# Altium schematic sheet RPi_Peripheral_HAT.SchDoc: Raspberry Pi Peripherals
size A4; DocumentNumber: SCH-PI-SHIELD; Revision: A; SheetNumber: 3; SheetTotal: 3
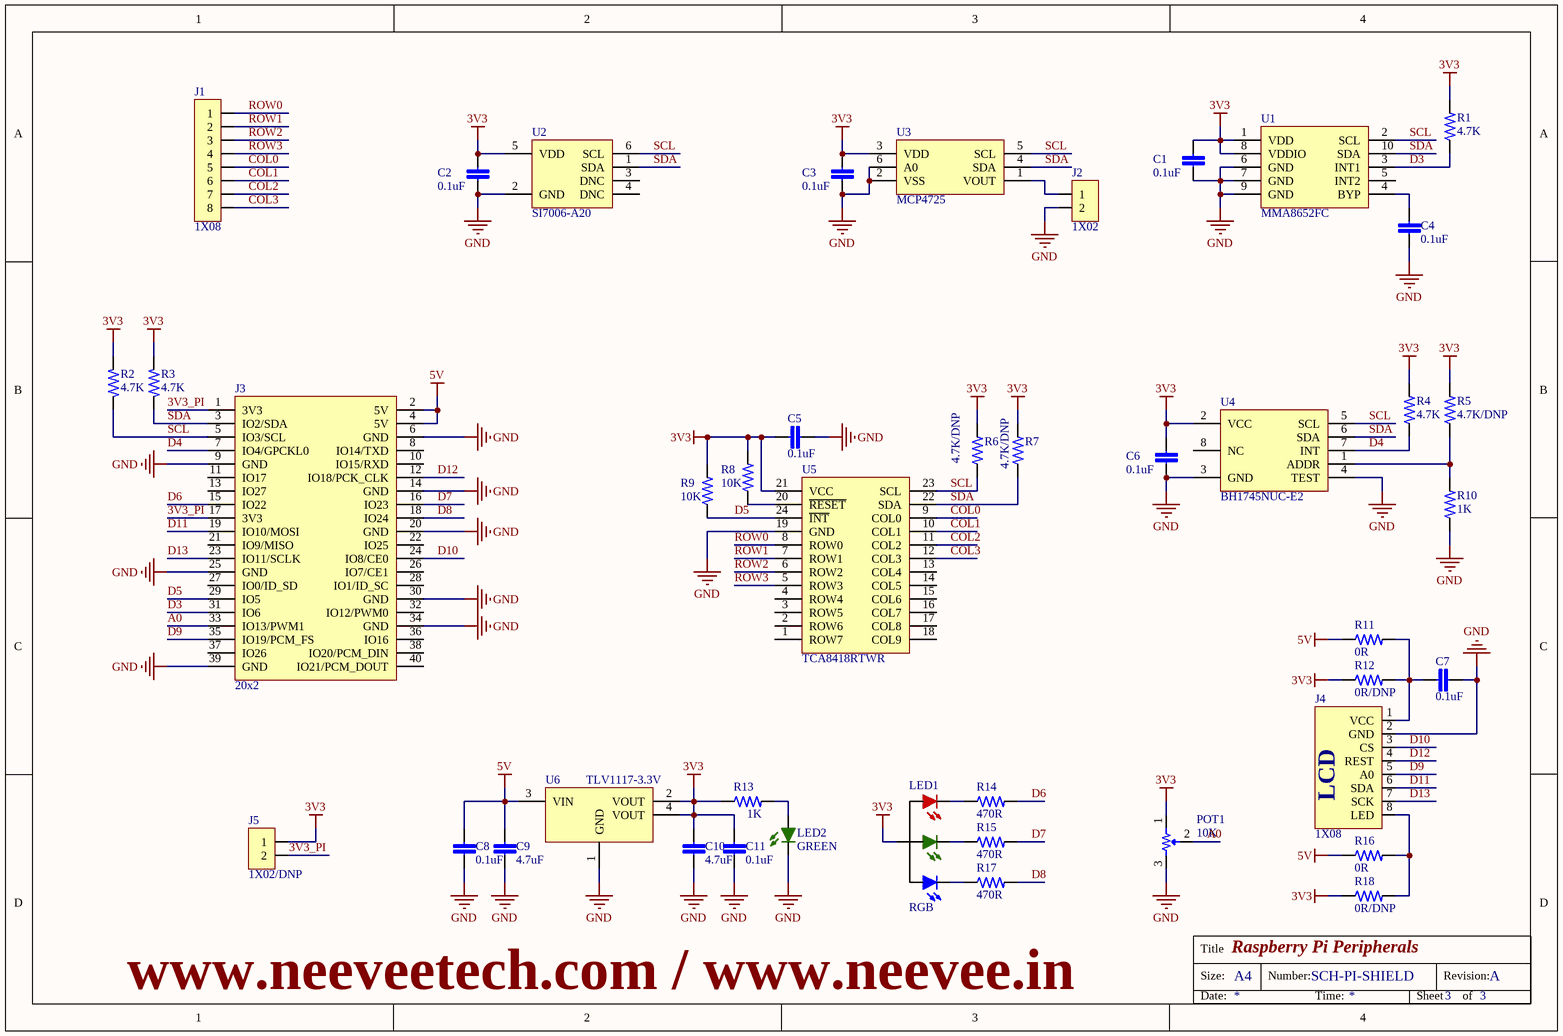
[diagram p0: RPi_Peripheral_HAT.SchDoc]

## Parts
C1  0.1uF  [C0603]
C2  0.1uF  [C0603]
C3  0.1uF  [C0603]
C4  0.1uF  [C0603]
C5  0.1uF  [C0603]
C6  0.1uF  [C0603]
C7  0.1uF  [C0603]
C8  0.1uF  [C0603]
C9  4.7uF  [C0603]
C10  4.7uF  [C0603]
C11  0.1uF  [C0603]
J1  1X08  [CON_1X08_2.54mm_male_TH]
J2  1X02  [CON_1X02_5MM]
J3  20x2  [RPI_HEADER_2X20_FEMALE]
J4  1X08  [CON_1X08_2.54mm_Female_TH]
J5  1X02/DNP  [CON_1X02_2.54mm_Male]
LED1  RGB  [PLCC4]
LED2  GREEN  [LED_0805_GREEN]
POT1  10K  [PTV09A_POTENTIOMETER]
R1  4.7K  [R0603]
R2  4.7K  [R0603]
R3  4.7K  [R0603]
R4  4.7K  [R0603]
R5  4.7K/DNP  [R0603]
R6  4.7K/DNP  [R0603]
R7  4.7K/DNP  [R0603]
R8  10K  [R0603]
R9  10K  [R0603]
R10  1K  [R0603]
R11  0R  [R0603]
R12  0R/DNP  [R0603]
R13  1K  [R0603]
R14  470R  [R0603]
R15  470R  [R0603]
R16  0R  [R0603]
R17  470R  [R0603]
R18  0R/DNP  [R0603]
U1  MMA8652FC  [DFN10]
U2  SI7006-A20  [DFN6]
U3  MCP4725  [SOT23-6]
U4  BH1745NUC-E2  [DFN8]
U5  TCA8418RTWR  [QFN24-0.5mm]
U6  TLV1117-3.3V  [SOT223]

## Nets
3V3: C1.2 C2.2 C3.2 C5.2 C6.2 C10.1 C11.2 J5.1 LED1.1(CA) POT1.1 R1.2 R2.2 R3.2 R4.2 R5.2 R6.2 R7.2 R8.2 R9.2 R12.1 R13.1 R18.1 U1.1(VDD) U1.8(VDDIO) U2.5(VDD) U3.3(VDD) U4.2(VCC) U5.21(VCC) U6.2(VOUT) U6.4(VOUT)
5V: C8.2 C9.1 J3.2(5V) J3.4(5V) R11.1 R16.1 U6.3(VIN)
GND: C1.1 C2.1 C3.1 C4.2 C5.1 C6.1 C7.2 C8.1 C9.2 C10.2 C11.1 J2.2 J3.6(GND) J3.9(GND) J3.14(GND) J3.20(GND) J3.25(GND) J3.30(GND) J3.34(GND) J3.39(GND) J4.2(GND) LED2.C POT1.3 R10.1 U1.6(GND) U1.7(GND) U1.9(GND) U2.2(GND) U3.2(VSS) U3.6(A0) U4.3(GND) U4.4(TEST) U5.19(GND) U6.1(GND)
3V3_PI: J3.1(3V3) J3.17(3V3) J5.2
A0: J3.33(IO13/PWM1) POT1.2
COL0: J1.5 U5.9(COL0)
COL1: J1.6 U5.10(COL1)
COL2: J1.7 U5.11(COL2)
COL3: J1.8 U5.12(COL3)
D3: J3.31(IO6) R1.1 U1.3(INT1)
D4: J3.7(IO4/GPCKL0) R4.1 U4.7(INT)
D5: J3.29(IO5) R9.1 U5.24(~{INT})
D6: J3.15(IO22) R14.2
D7: J3.16(IO23) R15.2
D8: J3.18(IO24) R17.2
D9: J3.35(IO19/PCM_FS) J4.5(A0)
D10: J3.24(IO8/CE0) J4.3(CS)
D11: J3.19(IO10/MOSI) J4.6(SDA)
D12: J3.12(IO18/PCK_CLK) J4.4(REST)
D13: J3.23(IO11/SCLK) J4.7(SCK)
ROW0: J1.1 U5.8(ROW0)
ROW1: J1.2 U5.7(ROW1)
ROW2: J1.3 U5.6(ROW2)
ROW3: J1.4 U5.5(ROW3)
SCL: J3.5(IO3/SCL) R2.1 R6.1 U1.2(SCL) U2.6(SCL) U3.5(SCL) U4.5(SCL) U5.23(SCL)
SDA: J3.3(IO2/SDA) R3.1 R7.1 U1.10(SDA) U2.1(SDA) U3.4(SDA) U4.6(SDA) U5.22(SDA)
NetC4_1: C4.1 U1.4(BYP)
NetC7_1: C7.1 J4.1(VCC) R11.2 R12.2
NetJ2_1: J2.1 U3.1(VOUT)
NetJ4_8: J4.8(LED) R16.2 R18.2
NetLED1_2: LED1.2(BLUE) R17.1
NetLED1_3: LED1.3(GREEN) R15.1
NetLED1_4: LED1.4(RED) R14.1
NetLED2_A: LED2.A R13.2
NetR5_1: R5.1 R10.2 U4.1(ADDR)
NetR8_1: R8.1 U5.20(~{RESET})

Not connected (* = marked no-connect by the designer): J3 8(IO14/TXD) 10(IO15/RXD) 11(IO17) 13(IO27) 21(IO9/MISO) 22(IO25) 26(IO7/CE1) 27(IO0/ID_SD) 28(IO1/ID_SC) 32(IO12/PWM0) 36(IO16) 37(IO26) 38(IO20/PCM_DIN) 40(IO21/PCM_DOUT); U1 5(INT2); U2 3(DNC) 4(DNC); U4 8(NC); U5 1(ROW7) 2(ROW6) 3(ROW5) 4(ROW4) 13(COL4) 14(COL5) 15(COL6) 16(COL7) 17(COL8) 18(COL9)

## Notes on the sheet
- www.neeveetech.com / www.neevee.in
- Title
- Size:
- A4
- Number:
- Revision:
- Date:
- Time:
- Sheet
- of
- (in symbol 1.44Inch_TFT_LCD_Con) LCD

## Library data of the parts
C1-C8 C11 = C0603_0.1uF: Cap Ceramic 0.1uF 50V X7R 20% SMD 0603 125C T/R; Manufacturer: KEMET; Manufacturer Part Number: C0603C104M5RACTU; Capacitance: 100nF; Dissipation Factor: 2.5%; Supplier 1: Element14; Supplier Part Number 1: 2725587; Stock 1: 8000; Mount: Surface Mount,PCB; Case/Package: 0603; Case Code (Metric): 1608; Case Code (Imperial): 0603; Dielectric Material: Ceramic; Contact Plating: Tin,Matte; Min Operating Temperature: -55°C; Max Operating Temperature: 125°C; Tolerance: 20%; Dielectric: X7R; Package Quantity: 1; Voltage Rating: 50V; Packaging: Tape and Reel; Voltage Rating (DC): 50V; Termination: SMD/SMT; Length: 1.6mm; Height: 0.8mm; Width: 0.031inch; Thickness: 0.034inch; Lead Pitch: 0.7mm; Depth: 0.8mm; Radiation Hardening: No; REACH SVHC: No SVHC; ComponentLink1URL: http://www.farnell.com/datasheets/2746056.pdf?src-supplier=Element14; ComponentLink1Description: http://www.farnell.com/datasheets/2746056.pdf?src-supplier=Element14; ComponentLink2URL: http://www.mouser.com/ds/2/212/KEM_C1002_X7R_SMD-1102033.pdf?src-supplier=Mouser; ComponentLink2Description: http://www.mouser.com/ds/2/212/KEM_C1002_X7R_SMD-1102033.pdf?src-supplier=Mouser; ComponentLink3URL: https://www.verical.com/server-webapp/html/getDatasheet?partID=626892&src-supplier=Verical; ComponentLink3Description: https://www.verical.com/server-webapp/html/getDatasheet?partID=626892&src-supplier=Verical; ComponentLink4URL: http://components.arrow.com/part/dataview/40911037S8853915N7429?src-supplier=Arrow; ComponentLink4Description: http://components.arrow.com/part/dataview/40911037S8853915N7429?src-supplier=Arrow; ComponentLink5URL: http://capacitoredge.kemet.com/capedge2/DataSheet?pn=C0603C104M5RAC7867&src-supplier=Avnet; ComponentLink5Description: http://capacitoredge.kemet.com/capedge2/DataSheet?pn=C0603C104M5RAC7867&src-supplier=Avnet; ComponentLink6URL: http://capacitoredge.kemet.com/capedge2/DataSheet?pn=C0603C104M5RAC7867&src-supplier=Avnet+Asia; ComponentLink6Description: http://capacitoredge.kemet.com/capedge2/DataSheet?pn=C0603C104M5RAC7867&src-supplier=Avnet+Asia; ComponentLink7URL: http://www.farnell.com/datasheets/2746056.pdf?src-supplier=Farnell; ComponentLink7Description: http://www.farnell.com/datasheets/2746056.pdf?src-supplier=Farnell; ComponentLink8URL: http://www.farnell.com/datasheets/2746056.pdf?src-supplier=Newark; ComponentLink8Description: http://www.farnell.com/datasheets/2746056.pdf?src-supplier=Newark; ComponentLink9URL: http://www.alliedelec.com/m/d/6f3b5eb83d09db50ed28bdc730567b33.pdf?src-supplier=Allied+Electronics; ComponentLink9Description: http://www.alliedelec.com/m/d/6f3b5eb83d09db50ed28bdc730567b33.pdf?src-supplier=Allied+Electronics; ComponentLink10URL: https://api.kemet.com/component-edge/download/datasheet/C0603C104M5RACTU.pdf?src-supplier=Digi-Key; ComponentLink10Description: https://api.kemet.com/component-edge/download/datasheet/C0603C104M5RACTU.pdf?src-supplier=Digi-Key; ComponentLink11URL: http://www.farnell.com/datasheets/2315113.pdf?src-supplier=Newark; ComponentLink11Description: http://www.farnell.com/datasheets/2315113.pdf?src-supplier=Newark; ComponentLink12URL: http://www.farnell.com/datasheets/1828800.pdf?src-supplier=Newark; ComponentLink12Description: http://www.farnell.com/datasheets/1828800.pdf?src-supplier=Newark; ComponentLink13URL: http://components.arrow.com/part/dataview/0323_00313986?src-supplier=Arrow+Europe; ComponentLink13Description: http://components.arrow.com/part/dataview/0323_00313986?src-supplier=Arrow+Europe; ComponentLink14URL: https://www.verical.com/server-webapp/html/getDatasheet?partID=110138&src-supplier=Verical; ComponentLink14Description: https://www.verical.com/server-webapp/html/getDatasheet?partID=110138&src-supplier=Verical
C9 C10 = C0603_4.7uF_10V: 4.7µF ±10% 10V Ceramic Capacitor X6S 0603 (1608 Metric); Manufacturer: TDK; Manufacturer Part Number: C1608X6S1A475K080AC; Supplier 1: Element14; Supplier Part Number 1: 2525106; Stock 1: 2640; Mount: Surface Mount; Case/Package: 0603; Number of Pins: 2; Weight: 7.1E-05oz; Case Code (Metric): 1608; Case Code (Imperial): 0603; Dielectric Material: Ceramic; Min Operating Temperature: -55°C; Max Operating Temperature: 105°C; Tolerance: 10%; Capacitance: 4.7uF; Dielectric: X6S; Packaging: Tape and Reel; Voltage Rating: 10V; Voltage Rating (DC): 10V; Termination: SMD/SMT; Package Quantity: 4000; Composition: Ceramic; Length: 1.6mm; Height: 0.8mm; Depth: 0.8mm; Width: 0.031inch; Thickness: 0.035inch; Radiation Hardening: No; Lead Free: Lead Free; REACH SVHC: Unknown; ComponentLink1URL: http://www.farnell.com/datasheets/2792994.pdf?src-supplier=Newark; ComponentLink1Description: http://www.farnell.com/datasheets/2792994.pdf?src-supplier=Newark; ComponentLink2URL: https://product.tdk.com/info/en/catalog/spec/mlccspec_commercial_general_midvoltage_en.pdf?src-supplier=Digi-Key; ComponentLink2Description: https://product.tdk.com/info/en/catalog/spec/mlccspec_commercial_general_midvoltage_en.pdf?src-supplier=Digi-Key; ComponentLink3URL: http://www.tdk.co.jp/tefe02/e412_c.pdf?src-supplier=Future+Electronics; ComponentLink3Description: http://www.tdk.co.jp/tefe02/e412_c.pdf?src-supplier=Future+Electronics; ComponentLink4URL: http://www.farnell.com/datasheets/1913358.pdf?src-supplier=Element14; ComponentLink4Description: http://www.farnell.com/datasheets/1913358.pdf?src-supplier=Element14; ComponentLink5URL: http://www.tdk.co.jp/tefe02/e412_c.pdf?src-supplier=Avnet+Europe; ComponentLink5Description: http://www.tdk.co.jp/tefe02/e412_c.pdf?src-supplier=Avnet+Europe; ComponentLink6URL: http://www.mouser.com/ds/2/400/lcc_commercial_general_en-837201.pdf?src-supplier=Mouser; ComponentLink6Description: http://www.mouser.com/ds/2/400/lcc_commercial_general_en-837201.pdf?src-supplier=Mouser
J1 = CON_1X08_2.54mm_male_TH: Connector Header Through Hole 8 position 0.100" (2.54mm); Manufacturer: Amphenol FCI; Manufacturer Part Number: 77311-818-08LF; Number of Contacts: 8; Connector Type: Male Pin; Current Rating: 3A; Voltage Rating: 1.5kV; Insulation Resistance: 5GR; Gender: Male; Contact Post Length: 3.05mm; Supplier 1: Element14; Supplier Part Number 1: 3273024; Stock 1: 0; Mount: Through Hole; Contact Plating: Gold,GXT; Color: Black; Contact Material: Bronze; Housing Color: Black; Housing Material: Thermoplastic; Min Operating Temperature: -65°C; Max Operating Temperature: 125°C; Number of Rows: 1; Termination: Solder; Packaging: Bulk; Package Quantity: 500; Number of Positions: 8; Contact Gender: Male; Max Voltage Rating (AC): 1.5kV; Orientation: Straight; Length: 20.32mm; Pitch: 2.54mm; Contact Mating Length: 0.23inch; Depth: 2.4mm; Radiation Hardening: No; Lead Free: Lead Free; Flammability Rating: UL94 V-0; ComponentLink1URL: http://portal.fciconnect.com/Comergent//fci/drawing/77311.pdf?src-supplier=Digi-Key; ComponentLink1Description: http://portal.fciconnect.com/Comergent//fci/drawing/77311.pdf?src-supplier=Digi-Key; ComponentLink2URL: http://portal.fciconnect.com/Comergent/fci/drawing/77311.pdf?src-supplier=Avnet; ComponentLink2Description: http://portal.fciconnect.com/Comergent/fci/drawing/77311.pdf?src-supplier=Avnet
J2 = CON_1X02_5mm: Wire-To-Board Terminal Block, 5 mm, 2 Ways, 22 AWG, 14 AWG, 1.5 mm, Screw; Manufacturer: Camden Electronics Boss; Manufacturer Part Number: CTBP5000/2; Current Rating: 16A; Voltage Rating: 250V; Wire/Cable Gauge: 22AWG; Supplier 1: Element14; Supplier Part Number 1: 2527547; Stock 1: 4037; REACH SVHC: No SVHC; ComponentLink1URL: http://www.farnell.com/datasheets/2018285.pdf?src-supplier=Farnell; ComponentLink1Description: http://www.farnell.com/datasheets/2018285.pdf?src-supplier=Farnell; ComponentLink2URL: http://www.farnell.com/datasheets/2018285.pdf?src-supplier=Element14; ComponentLink2Description: http://www.farnell.com/datasheets/2018285.pdf?src-supplier=Element14
J3 = RPI_HEADER_20X2_FEMALE: GPIO FEMALE HEADER RASPBERRY PI; Manufacturer: Adafruit Industries; Manufacturer Part Number: 2222; Supplier 1: Digi-Key; Supplier Part Number 1: 1528-1785-ND; Stock 1: 1455; Pricing 1: 1=1.5 (USD); ComponentLink1URL: https://cdn-shop.adafruit.com/product-files/2222/00587.pdf?src-supplier=Digi-Key; ComponentLink1Description: https://cdn-shop.adafruit.com/product-files/2222/00587.pdf?src-supplier=Digi-Key
J4 = 1.44Inch_TFT_LCD_Con: Board-To-Board Connector, 2.54 mm, 10 Contacts, Receptacle, 2212S Series, Through Hole, 1 Rows; Manufacturer: Multicomp; Manufacturer Part Number: 2212S-10SG-85; Number of Contacts: 10; Insulation Resistance: 1GR; Supplier 1: Element14; Supplier Part Number 1: 1593464; Stock 1: 6706; Mount: Through Hole; Weight: 0.11lb; Contact Plating: Gold; Contact Material: Copper Alloy; Number of Rows: 1; Termination: Through Hole; Gender: Receptacle; Length: 1.02inch; Height: 0.35inch; Width: 0.12inch; REACH SVHC: No SVHC; Flammability Rating: UL94 V-0; ComponentLink1URL: http://www.farnell.com/datasheets/1662126.pdf?src-supplier=Element14; ComponentLink1Description: http://www.farnell.com/datasheets/1662126.pdf?src-supplier=Element14
J5 = CON_1X02_2.54mm_Male: Connector Header Through Hole 2 position 0.100" (2.54mm); Manufacturer: Amphenol FCI; Manufacturer Part Number: 77311-818-02LF; Number of Contacts: 2; Current Rating: 3A; Voltage Rating: 1.5kV; Gender: Male; Connector Type: Male Pin; Insulation Resistance: 5GR; Contact Post Length: 3.05mm; DNP: YES; Supplier 1: Element14; Supplier Part Number 1: 2892471; Stock 1: 990; Mount: Through Hole; Contact Plating: Gold,GXT; Color: Black; Contact Material: Bronze; Housing Material: Thermoplastic; Housing Color: Black; Min Operating Temperature: -65°C; Max Operating Temperature: 125°C; Number of Rows: 1; Termination: Solder; Package Quantity: 1000; Packaging: Bulk; Number of Positions: 2; Max Voltage Rating (AC): 1.5kV; Orientation: Straight; Contact Gender: Male; Length: 5.08mm; Pitch: 2.54mm; Depth: 2.4mm; Contact Mating Length: 0.23inch; Radiation Hardening: No; Lead Free: Lead Free; ComponentLink1URL: http://portal.fciconnect.com/Comergent//fci/drawing/77311.pdf?src-supplier=Digi-Key; ComponentLink1Description: http://portal.fciconnect.com/Comergent//fci/drawing/77311.pdf?src-supplier=Digi-Key; ComponentLink2URL: http://portal.fciconnect.com/Comergent/fci/drawing/77311.pdf?src-supplier=Avnet; ComponentLink2Description: http://portal.fciconnect.com/Comergent/fci/drawing/77311.pdf?src-supplier=Avnet
LED1 = LED_RGB: Red, Green, Blue (RGB) 625nm Red, 530nm Green, 470nm Blue LED Indication - Discrete 2.1V Red, 3.1V Green, 3.1V Blue 4-PLCC; Manufacturer: Broadcom Avago; Manufacturer Part Number: ASMB-MTB0-0A3A2; Color: Blue,Green,Red; Lens Style: Circular,Diffused,Round; Viewing Angle: 115°; Luminous Intensity: 1.6cd; Number of LEDs: 3; Supplier 1: Element14; Supplier Part Number 1: 2401105; Stock 1: 102671; Mount: Surface Mount; Number of Pins: 4; Contact Plating: Silver; Min Operating Temperature: -40°C; Max Operating Temperature: 85°C; Packaging: Cut Tape; Forward Voltage: 3.1V; Dominant Wavelength: 625nm; REACH SVHC: No SVHC; ComponentLink1URL: http://www.avagotech.com/docs/AV02-4186EN?src-supplier=Avnet; ComponentLink1Description: http://www.avagotech.com/docs/AV02-4186EN?src-supplier=Avnet; ComponentLink2URL: http://uk.rs-online.com/webdocs/133c/0900766b8133c17d.pdf?src-supplier=RSComponents; ComponentLink2Description: http://uk.rs-online.com/webdocs/133c/0900766b8133c17d.pdf?src-supplier=RSComponents; ComponentLink3URL: https://docs.broadcom.com/docs/AV02-4186EN?src-supplier=Digi-Key; ComponentLink3Description: https://docs.broadcom.com/docs/AV02-4186EN?src-supplier=Digi-Key; ComponentLink4URL: http://www.farnell.com/datasheets/1801563.pdf?src-supplier=Element14; ComponentLink4Description: http://www.farnell.com/datasheets/1801563.pdf?src-supplier=Element14; ComponentLink5URL: http://www.farnell.com/datasheets/2343968.pdf?src-supplier=Farnell; ComponentLink5Description: http://www.farnell.com/datasheets/2343968.pdf?src-supplier=Farnell
LED2 = LED0805_GREEN: KP-2012LCGCK -  LED, Low Power, Green, SMD, 0805, 2 mA, 1.9 V, 570 nm; Manufacturer: Kingbright; Forward Voltage: 1.9V; Luminous Intensity: 3mcd; Wavelength: 570nm; Viewing Angle: 120°; Forward Current: 2mA; Lens Style: Rectangular; Supplier 1: Element14; Supplier Part Number 1: 2464005RL; Manufacturer Part Number: KP-2012LCGCK; Stock 1: 0; Case/Package: SMD/SMT; Color: Green; Packaging: Tape and Reel; REACH SVHC: No SVHC; ComponentLink1URL: http://www.farnell.com/datasheets/1854079.pdf?src-supplier=Element14; ComponentLink1Description: http://www.farnell.com/datasheets/1854079.pdf?src-supplier=Element14; ComponentLink2URL: http://www.farnell.com/datasheets/1854079.pdf?src-supplier=Farnell; ComponentLink2Description: http://www.farnell.com/datasheets/1854079.pdf?src-supplier=Farnell; ComponentLink3URL: http://www.farnell.com/datasheets/1854079.pdf?src-supplier=Newark; ComponentLink3Description: http://www.farnell.com/datasheets/1854079.pdf?src-supplier=Newark
POT1 = PTV09A-4015U-B103: 10k Ohm 1 Gang Linear Through Hole, Snap In Potentiometer None 1 Kierros Carbon 0.05W, 1/20W PC Pins, Board Locks; Manufacturer: Bourns; Resistance: 10kR; Tolerance: 20%; Number of Turns: 1; Max Power Dissipation: 50mW; Actuator Length: 0.591inch; Actuator Diameter: 0.236inch; Supplier 1: Element14; Supplier Part Number 1: 2814328; Manufacturer Part Number: PTV09A-4015U-B103; Stock 1: 94; Mount: Through Hole,Snap in,Brackets; Min Operating Temperature: -10°C; Max Operating Temperature: 50°C; Type: Potentiometer; Package Quantity: 100; Packaging: Bulk; Taper: Linear; Termination: Pin; Number of Gangs: 1; Composition: Carbon; Military Standard: Not; Length: 11.4mm; Depth: 12.5mm; Radiation Hardening: No; ComponentLink1URL: http://www.bourns.com/docs/Product-Datasheets/PTV09.pdf?src-supplier=Digi-Key; ComponentLink1Description: http://www.bourns.com/docs/Product-Datasheets/PTV09.pdf?src-supplier=Digi-Key; ComponentLink2URL: http://www.bourns.com/data/global/pdfs/PTV09.pdf?src-supplier=Avnet; ComponentLink2Description: http://www.bourns.com/data/global/pdfs/PTV09.pdf?src-supplier=Avnet
R1-R4 = R0603_4.7K: SMD Chip Resistor, 0603 [1608 Metric], 4.7 kohm, MCWR Series, 75 V, Thick Film, 100 mW; Manufacturer: Multicomp; Manufacturer Part Number: MCWR06X4701FTL; Resistance: 4.7kR; Power Rating: 100mW; Tolerance: 1%; Voltage Rating: 50V; Temperature Coefficient: 100ppm/°C; Supplier 1: Element14; Supplier Part Number 1: 2447385; Stock 1: 259804; Mount: Surface Mount; Case/Package: 0603; Case Code (Metric): 1608; Case Code (Imperial): 0603; Packaging: Cut Tape; Composition: Thick Film; Voltage Rating (DC): 50V; REACH SVHC: No SVHC; ComponentLink1URL: http://www.farnell.com/datasheets/2563624.pdf?src-supplier=Element14; ComponentLink1Description: http://www.farnell.com/datasheets/2563624.pdf?src-supplier=Element14
R5-R7 = R0603_4.7K/DNP: SMD Chip Resistor, 0603 [1608 Metric], 4.7 kohm, MCWR Series, 75 V, Thick Film, 100 mW (DNP); Manufacturer: Multicomp; Manufacturer Part Number: MCWR06X4701FTL; Resistance: 4.7kR; Power Rating: 100mW; Tolerance: 1%; Voltage Rating: 50V; Temperature Coefficient: 100ppm/°C; DNP: YES; Supplier 1: Element14; Supplier Part Number 1: 2447385; Stock 1: 259804; Mount: Surface Mount; Case/Package: 0603; Case Code (Metric): 1608; Case Code (Imperial): 0603; Packaging: Cut Tape; Composition: Thick Film; Voltage Rating (DC): 50V; REACH SVHC: No SVHC; ComponentLink1URL: http://www.farnell.com/datasheets/2563624.pdf?src-supplier=Element14; ComponentLink1Description: http://www.farnell.com/datasheets/2563624.pdf?src-supplier=Element14
R8 R9 = R0603_10K: SMD Chip Resistor, 0603 [1608 Metric], 10 kohm, MCWR Series, 75 V, Thick Film, 100 mW; Manufacturer: Multicomp; Manufacturer Part Number: MCWR06X1002FTL; Resistance: 10kR; Voltage Rating: 50V; Power Rating: 100mW; Tolerance: 1%; Temperature Coefficient: 100ppm/°C; Supplier 1: Element14; Supplier Part Number 1: 2447230; Stock 1: 817927; Case/Package: 0603; Case Code (Metric): 1608; Case Code (Imperial): 0603; Packaging: Tape and Reel; Composition: Thick Film; Voltage Rating (DC): 50V; REACH SVHC: No SVHC; ComponentLink1URL: http://www.farnell.com/datasheets/2860681.pdf?src-supplier=Farnell; ComponentLink1Description: http://www.farnell.com/datasheets/2860681.pdf?src-supplier=Farnell; ComponentLink2URL: http://www.farnell.com/datasheets/2563624.pdf?src-supplier=Farnell; ComponentLink2Description: http://www.farnell.com/datasheets/2563624.pdf?src-supplier=Farnell; ComponentLink3URL: http://www.farnell.com/datasheets/1849611.pdf?src-supplier=Element14; ComponentLink3Description: http://www.farnell.com/datasheets/1849611.pdf?src-supplier=Element14; ComponentLink4URL: http://www.farnell.com/datasheets/2563624.pdf?src-supplier=Newark; ComponentLink4Description: http://www.farnell.com/datasheets/2563624.pdf?src-supplier=Newark
R10 R13 = R0603_1K: SMD Chip Resistor, 0603 [1608 Metric], 1 kohm, MCWR Series, 75 V, Thick Film, 100 mW; Manufacturer: Multicomp; Manufacturer Part Number: MCWR06X1001FTL; Resistance: 1kR; Power Rating: 100mW; Tolerance: 1%; Voltage Rating: 50V; Temperature Coefficient: 100ppm/°C; Supplier 1: Element14; Supplier Part Number 1: 2447272; Stock 1: 250324; Mount: Surface Mount; Case/Package: 0603; Case Code (Metric): 1608; Case Code (Imperial): 0603; Packaging: Cut Tape; Composition: Thick Film; Voltage Rating (DC): 50V; REACH SVHC: No SVHC; ComponentLink1URL: http://www.farnell.com/datasheets/1849611.pdf?src-supplier=Element14; ComponentLink1Description: http://www.farnell.com/datasheets/1849611.pdf?src-supplier=Element14; ComponentLink2URL: http://www.farnell.com/datasheets/2563624.pdf?src-supplier=Farnell; ComponentLink2Description: http://www.farnell.com/datasheets/2563624.pdf?src-supplier=Farnell; ComponentLink3URL: http://www.farnell.com/datasheets/2860681.pdf?src-supplier=Farnell; ComponentLink3Description: http://www.farnell.com/datasheets/2860681.pdf?src-supplier=Farnell
R11 R16 = R0603_0R: SMD Chip Resistor, Jumper, 0603 [1608 Metric], 0 ohm, MCWR Series, 75 V, Thick Film, 100 mW; Manufacturer: Multicomp; Manufacturer Part Number: MCWR06X000PTL; Resistance: 0mR; Power Rating: 100mW; Voltage Rating: 50V; Temperature Coefficient: 400ppm/°C; Supplier 1: Element14; Supplier Part Number 1: 2447743; Stock 1: 336127; Mount: Surface Mount; Case/Package: 0603; Case Code (Metric): 1608; Case Code (Imperial): 0603; Packaging: Cut Tape; Composition: Thick Film; Voltage Rating (DC): 50V; REACH SVHC: No SVHC; ComponentLink1URL: http://www.farnell.com/datasheets/1849611.pdf?src-supplier=Element14; ComponentLink1Description: http://www.farnell.com/datasheets/1849611.pdf?src-supplier=Element14
R12 R18 = R0603_0R_DNP: SMD Chip Resistor, Jumper, 0603 [1608 Metric], 0 ohm, MCWR Series, 75 V, Thick Film, 100 mW (DNP); Manufacturer: Multicomp; Manufacturer Part Number: MCWR06X000PTL; Resistance: 0mR; Power Rating: 100mW; Voltage Rating: 50V; Temperature Coefficient: 400ppm/°C; DNP: YES; Supplier 1: Element14; Supplier Part Number 1: 2447743; Stock 1: 336127; Mount: Surface Mount; Case/Package: 0603; Case Code (Metric): 1608; Case Code (Imperial): 0603; Packaging: Cut Tape; Composition: Thick Film; Voltage Rating (DC): 50V; REACH SVHC: No SVHC; ComponentLink1URL: http://www.farnell.com/datasheets/1849611.pdf?src-supplier=Element14; ComponentLink1Description: http://www.farnell.com/datasheets/1849611.pdf?src-supplier=Element14; Aseembly: DNP
R14 R15 R17 = R0603_470R: SMD Chip Resistor, 0603 [1608 Metric], 470 ohm, MCWR Series, 75 V, Thick Film, 100 mW; Manufacturer: Multicomp; Manufacturer Part Number: MCWR06X4700FTL; Power Rating: 100mW; Tolerance: 1%; Voltage Rating: 50V; Temperature Coefficient: 100ppm/°C; Supplier 1: Element14; Supplier Part Number 1: 2447374; Stock 1: 105020; Mount: Surface Mount; Case/Package: 0603; Case Code (Metric): 1608; Case Code (Imperial): 0603; Resistance: 470R; Packaging: Cut Tape; Composition: Thick Film; Voltage Rating (DC): 50V; REACH SVHC: Unknown
U1 = MMA8652FC: Accelerometer X, Y, Z Axis ±2g, 4g, 8g 0.78Hz ~ 400Hz 10-DFN (2x2); Manufacturer: NXP Freescale; Manufacturer Part Number: MMA8652FCR1; Output Type: I2C,Digital; Interface: I2C,Serial; Min Supply Voltage: 1.95V; Max Supply Voltage: 3.6V; Nominal Supply Current: 100mA; Resolution: 12b; Axis: X, Y, Z; Sensitivity: 1024LSB/g; Supplier 1: Element14; Supplier Part Number 1: 2377758; Stock 1: 60362; Case/Package: DFN; Number of Pins: 10; Weight: 0.000508oz; Min Operating Temperature: -40°C; Max Operating Temperature: 85°C; Package Quantity: 1000; Bandwidth: 400Hz; Packaging: Tape and Reel; Length: 2mm; Height: 0.95mm; Width: 2mm; REACH SVHC: No SVHC; Lead Free: Contains Lead; Halogen Free: Halogen Free; ComponentLink1URL: https://media.digikey.com/pdf/Data%20Sheets/NXP%20PDFs/MMA8652FC.pdf?src-supplier=Digi-Key; ComponentLink1Description: https://media.digikey.com/pdf/Data%20Sheets/NXP%20PDFs/MMA8652FC.pdf?src-supplier=Digi-Key; ComponentLink2URL: http://cache.freescale.com/files/sensors/doc/data_sheet/MMA8652FC.pdf?src-supplier=Mouser; ComponentLink2Description: http://cache.freescale.com/files/sensors/doc/data_sheet/MMA8652FC.pdf?src-supplier=Mouser; ComponentLink3URL: http://www.farnell.com/datasheets/2293691.pdf?src-supplier=Newark; ComponentLink3Description: http://www.farnell.com/datasheets/2293691.pdf?src-supplier=Newark; ComponentLink4URL: http://www.farnell.com/datasheets/1869253.pdf?src-supplier=Element14; ComponentLink4Description: http://www.farnell.com/datasheets/1869253.pdf?src-supplier=Element14
U2 = SI7006-A20-IM: Humidity Temperature Sensor 0 ~ 100% RH I²C ±5% RH 18s Surface Mount; Manufacturer: Silicon Labs; Output Type: I2C,Digital; Min Supply Voltage: 1.9V; Max Supply Voltage: 3.6V; Interface: I2C; Supplier 1: Element14; Supplier Part Number 1: 2473658; Manufacturer Part Number: SI7006-A20-IM; Stock 1: 178; Mount: Surface Mount; Case/Package: DFN; Number of Pins: 6; Min Operating Temperature: -40°C; Max Operating Temperature: 125°C; Response Time: 18s; Accuracy: 5%; Sensor Type: Temperature; Length: 3mm; Height: 0.75mm; Width: 3mm; REACH SVHC: Unknown; ComponentLink1URL: http://www.farnell.com/datasheets/2245062.pdf?src-supplier=Farnell; ComponentLink1Description: http://www.farnell.com/datasheets/2245062.pdf?src-supplier=Farnell; ComponentLink2URL: http://www.farnell.com/datasheets/1902509.pdf?src-supplier=Element14; ComponentLink2Description: http://www.farnell.com/datasheets/1902509.pdf?src-supplier=Element14; ComponentLink3URL: https://www.silabs.com/Support%20Documents%2fTechnicalDocs%2fSi7006-A20.pdf?src-supplier=Digi-Key; ComponentLink3Description: https://www.silabs.com/Support%20Documents%2fTechnicalDocs%2fSi7006-A20.pdf?src-supplier=Digi-Key; ComponentLink4URL: http://www.farnell.com/datasheets/2245062.pdf?src-supplier=Newark; ComponentLink4Description: http://www.farnell.com/datasheets/2245062.pdf?src-supplier=Newark; ComponentLink5URL: https://www.silabs.com/Support%20Documents%2FTechnicalDocs%2FSi7006-A20.pdf?src-supplier=Avnet+Asia; ComponentLink5Description: https://www.silabs.com/Support%20Documents%2FTechnicalDocs%2FSi7006-A20.pdf?src-supplier=Avnet+Asia
U3 = MCP4725: 12 Bit Digital to Analog Converter 1 SOT-23-6; Manufacturer: Microchip; Manufacturer Part Number: MCP4725A2T-E/CH; Resolution: 12b; Integral Nonlinearity (INL): 14.5LSB; Output Type: Voltage; Number of DAC Channels: 1; Interface: I2C,Serial,2-Wire; Max Supply Voltage: 5.5V; Min Supply Voltage: 2.7V; Settling Time: 6us; Number of Bits: 12; Polarity: Bipolar; Supply Type: Single; Conversion Rate: 3.4MS/s; Input Offset Voltage (Vos): 1.1mV; Nominal Supply Current: 210uA; Supplier 1: Element14; Supplier Part Number 1: 3102794; Stock 1: 2573; Mount: Surface Mount; Case/Package: SOT-23; Number of Pins: 6; Min Operating Temperature: -40°C; Max Operating Temperature: 125°C; Packaging: Tape and Reel; Number of Channels: 1; Package Quantity: 3000; Number of Converters: 1; Length: 3.1mm; Height: 1.3mm; Width: 1.8mm; Radiation Hardening: No; Lead Free: Lead Free; ComponentLink1URL: http://ww1.microchip.com/downloads/en/DeviceDoc/22039c.pdf?src-supplier=Avnet; ComponentLink1Description: http://ww1.microchip.com/downloads/en/DeviceDoc/22039c.pdf?src-supplier=Avnet; ComponentLink2URL: http://www.microchip.com/mymicrochip/filehandler.aspx?ddocname=en532676&src-supplier=Digi-Key; ComponentLink2Description: http://www.microchip.com/mymicrochip/filehandler.aspx?ddocname=en532676&src-supplier=Digi-Key; ComponentLink3URL: http://ww1.microchip.com/downloads/en/DeviceDoc/22039c.pdf?src-supplier=Avnet+Europe; ComponentLink3Description: http://ww1.microchip.com/downloads/en/DeviceDoc/22039c.pdf?src-supplier=Avnet+Europe; ComponentLink4URL: http://www.microchip.com/mymicrochip/filehandler.aspx?ddocname=en532676&src-supplier=Future+Electronics; ComponentLink4Description: http://www.microchip.com/mymicrochip/filehandler.aspx?ddocname=en532676&src-supplier=Future+Electronics
U4 = BH1745NUC-E2: ROHM - BH1745NUC-E2 - Colour Sensor, 16 Bit, I2C, Serial Output, 2.3 V to 3.6 V, WSON-8; Max Supply Current: 260uA; Min Supply Voltage: 2.3V; Max Supply Voltage: 3.6V; Supplier 1: Element14; Supplier Part Number 1: 2663354; Manufacturer: Rohm; Manufacturer Part Number: BH1745NUC-E2; Stock 1: 2398; Number of Pins: 8; Min Operating Temperature: -40°C; Max Operating Temperature: 85°C; REACH SVHC: No SVHC; Lead Free: Lead Free; ComponentLink1URL: http://www.farnell.com/datasheets/2148819.pdf?src-supplier=Element14; ComponentLink1Description: http://www.farnell.com/datasheets/2148819.pdf?src-supplier=Element14; ComponentLink2URL: http://rohmfs.rohm.com/en/products/databook/datasheet/ic/sensor/light/bh1745nuc-e.pdf?src-supplier=Avnet; ComponentLink2Description: http://rohmfs.rohm.com/en/products/databook/datasheet/ic/sensor/light/bh1745nuc-e.pdf?src-supplier=Avnet; ComponentLink3URL: http://rohmfs.rohm.com/en/techdata_basic/ic/package/wson008x2120_1-e.pdf?src-supplier=Digi-Key; ComponentLink3Description: http://rohmfs.rohm.com/en/techdata_basic/ic/package/wson008x2120_1-e.pdf?src-supplier=Digi-Key; ComponentLink4URL: http://www.farnell.com/datasheets/2148819.pdf?src-supplier=Newark; ComponentLink4Description: http://www.farnell.com/datasheets/2148819.pdf?src-supplier=Newark; ComponentLink5URL: http://rohmfs.rohm.com/en/products/databook/datasheet/ic/sensor/light/bh1745nuc-e.pdf?src-supplier=Digi-Key; ComponentLink5Description: http://rohmfs.rohm.com/en/products/databook/datasheet/ic/sensor/light/bh1745nuc-e.pdf?src-supplier=Digi-Key; ComponentLink6URL: http://www.farnell.com/datasheets/2148819.pdf?src-supplier=Farnell; ComponentLink6Description: http://www.farnell.com/datasheets/2148819.pdf?src-supplier=Farnell
U5 = TCA8418RTWR: TCA8418 I2C Controlled Keypad Scan IC With Integrated ESD Protection; Manufacturer: Texas Instruments; Min Supply Voltage: 1.65V; Max Supply Voltage: 3.6V; Number of Outputs: 18; Supplier 1: Element14; Supplier Part Number 1: 3009542; Manufacturer Part Number: TCA8418RTWR; Stock 1: 0; Case/Package: QFN; Number of Pins: 24; Contact Plating: Gold; Min Operating Temperature: -40°C; Max Operating Temperature: 85°C; Type: Integrated Circuit (IC); Package Quantity: 3000; Packaging: Tape and Reel; Length: 4.15mm; Height: 0.75mm; Width: 4.15mm; Radiation Hardening: No; REACH SVHC: No SVHC; Lead Free: Lead Free; ComponentLink1URL: http://www.ti.com/lit/ds/symlink/tca8418.pdf?src-supplier=Digi-Key; ComponentLink1Description: http://www.ti.com/lit/ds/symlink/tca8418.pdf?src-supplier=Digi-Key; ComponentLink2URL: http://www.ti.com/general/docs/lit/getliterature.tsp?genericPartNumber=TCA8418&&fileType=pdf&src-supplier=Element14; ComponentLink2Description: http://www.ti.com/general/docs/lit/getliterature.tsp?genericPartNumber=TCA8418&&fileType=pdf&src-supplier=Element14; ComponentLink3URL: http://www.mouser.com/ds/2/405/tca8418-445871.pdf?src-supplier=Mouser; ComponentLink3Description: http://www.mouser.com/ds/2/405/tca8418-445871.pdf?src-supplier=Mouser; ComponentLink4URL: http://datasheet.iiic.cc/texas_instruments/TCA8418RTWR.pdf?src-supplier=IIIC; ComponentLink4Description: http://datasheet.iiic.cc/texas_instruments/TCA8418RTWR.pdf?src-supplier=IIIC
U6 = TLV1117LV33: Fixed LDO Voltage Regulator, 2V to 5.5V, 455mV Dropout, 3.3Vout, 1Aout, SOT-223-4; Manufacturer: Texas Instruments; Manufacturer Part Number: TLV1117LV33DCYR; Max Power Dissipation: 1.59W; Output Voltage: 3.3V; Number of Outputs: 1; Output Current: 1A; Min Current Limit: 1.1A; Polarity: Positive; Quiescent Current: 50uA; Accuracy: 2%; Output Voltage Accuracy: 1.5%; Supplier 1: Element14; Supplier Part Number 1: 2437454; Stock 1: 0; Case/Package: SOT-223; Number of Pins: 4; Min Operating Temperature: -40°C; Max Operating Temperature: 125°C; Package Quantity: 1; Dropout Voltage: 455mV; Packaging: Tape and Reel; Nominal Output Voltage: 3.3V; Max Output Current: 1A; Max Input Voltage: 5.5V; Min Input Voltage: 2V; Number of Regulators: 1; Power Dissipation: 1.59W; Min Output Voltage: 3.3V; Max Output Voltage: 3.3V; Output Type: Fixed; Radiation Hardening: No; REACH SVHC: No SVHC; Lead Free: Lead Free; ComponentLink1URL: http://www.ti.com/lit/ds/symlink/tlv1117lv.pdf?src-supplier=Digi-Key; ComponentLink1Description: http://www.ti.com/lit/ds/symlink/tlv1117lv.pdf?src-supplier=Digi-Key; ComponentLink2URL: http://www.farnell.com/datasheets/1950591.pdf?src-supplier=Element14; ComponentLink2Description: http://www.farnell.com/datasheets/1950591.pdf?src-supplier=Element14